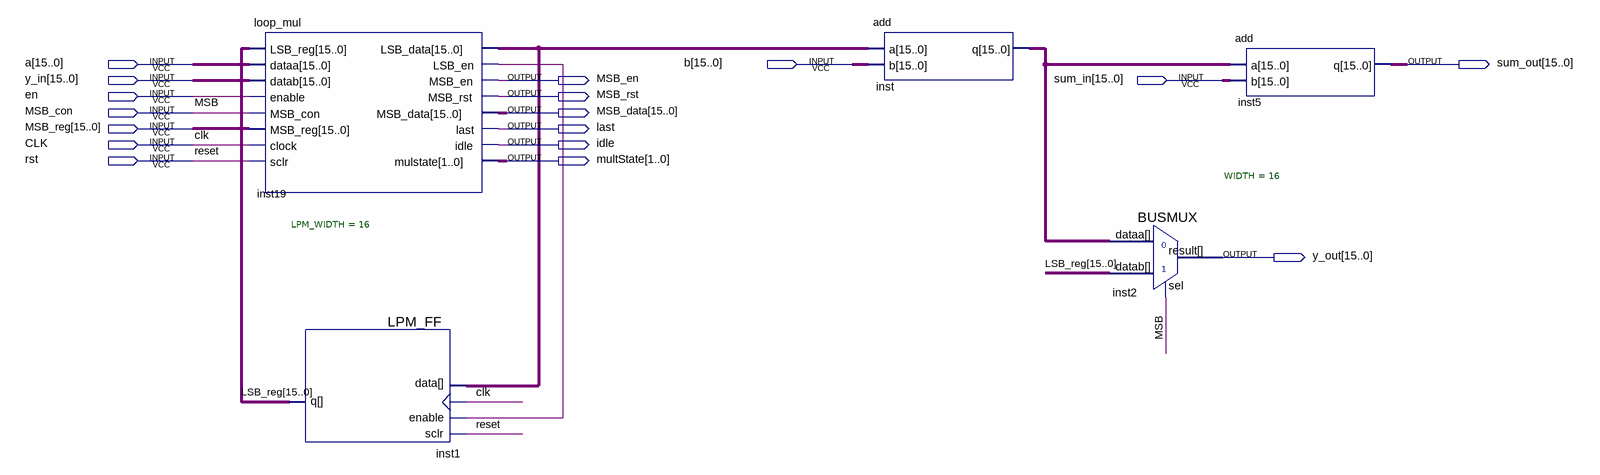
[diagram p0: schematic sheet]
// Quartus schematic MAD.bdf as structural Verilog: 5 symbols, 17 pins
module MAD (
  input  [15:0] a,
  input  [15:0] b,
  input  [15:0] y_in,
  input  [15:0] sum_in,
  input  en,
  input  MSB_con,
  input  [15:0] MSB_reg,
  input  CLK,
  input  rst,
  output [15:0] sum_out,
  output MSB_en,
  output MSB_rst,
  output [15:0] MSB_data,
  output last,
  output idle,
  output [1:0] multState,
  output [15:0] y_out
);

  wire inst19_lsb_en;
  wire [15:0] inst19_lsb_data, inst_q, LSB_reg;

  loop_mul inst19 (
    .LSB_reg(LSB_reg), .dataa(a), .datab(y_in), .enable(en), .MSB_con(MSB_con), .MSB_reg(MSB_reg),
    .clock(CLK), .sclr(rst), .LSB_data(inst19_lsb_data), .LSB_en(inst19_lsb_en), .MSB_en(MSB_en),
    .MSB_rst(MSB_rst), .MSB_data(MSB_data), .last(last), .idle(idle), .mulstate(multState));
  LPM_FF #(.LPM_WIDTH(16)) inst1 (.enable(inst19_lsb_en), .clock(CLK), .sclr(rst), .data(inst19_lsb_data), .q(LSB_reg));
  add inst (.a(inst19_lsb_data), .b(b), .q(inst_q));
  BUSMUX #(.WIDTH(16)) inst2 (.datab(LSB_reg), .sel(MSB_con), .dataa(inst_q), .result(y_out));
  add inst5 (.a(inst_q), .b(sum_in), .q(sum_out));

  // Other names for the same wires on the sheet: MSB = MSB_con; reset = rst
endmodule
